# EasyEDA Pro project ProPrj_AS5600磁编码器板(For2804电机_2026-04-13.epro

# Schematic Schematic1
Create Date: 2023-10-13; Page Name: P1; Project Name: AS5600磁编码器板(For2804电机; Schematic Name: Schematic1; Update Date: 2023-10-13; Company: 嘉立创EDA; Page Size: A4; Version: V1.0
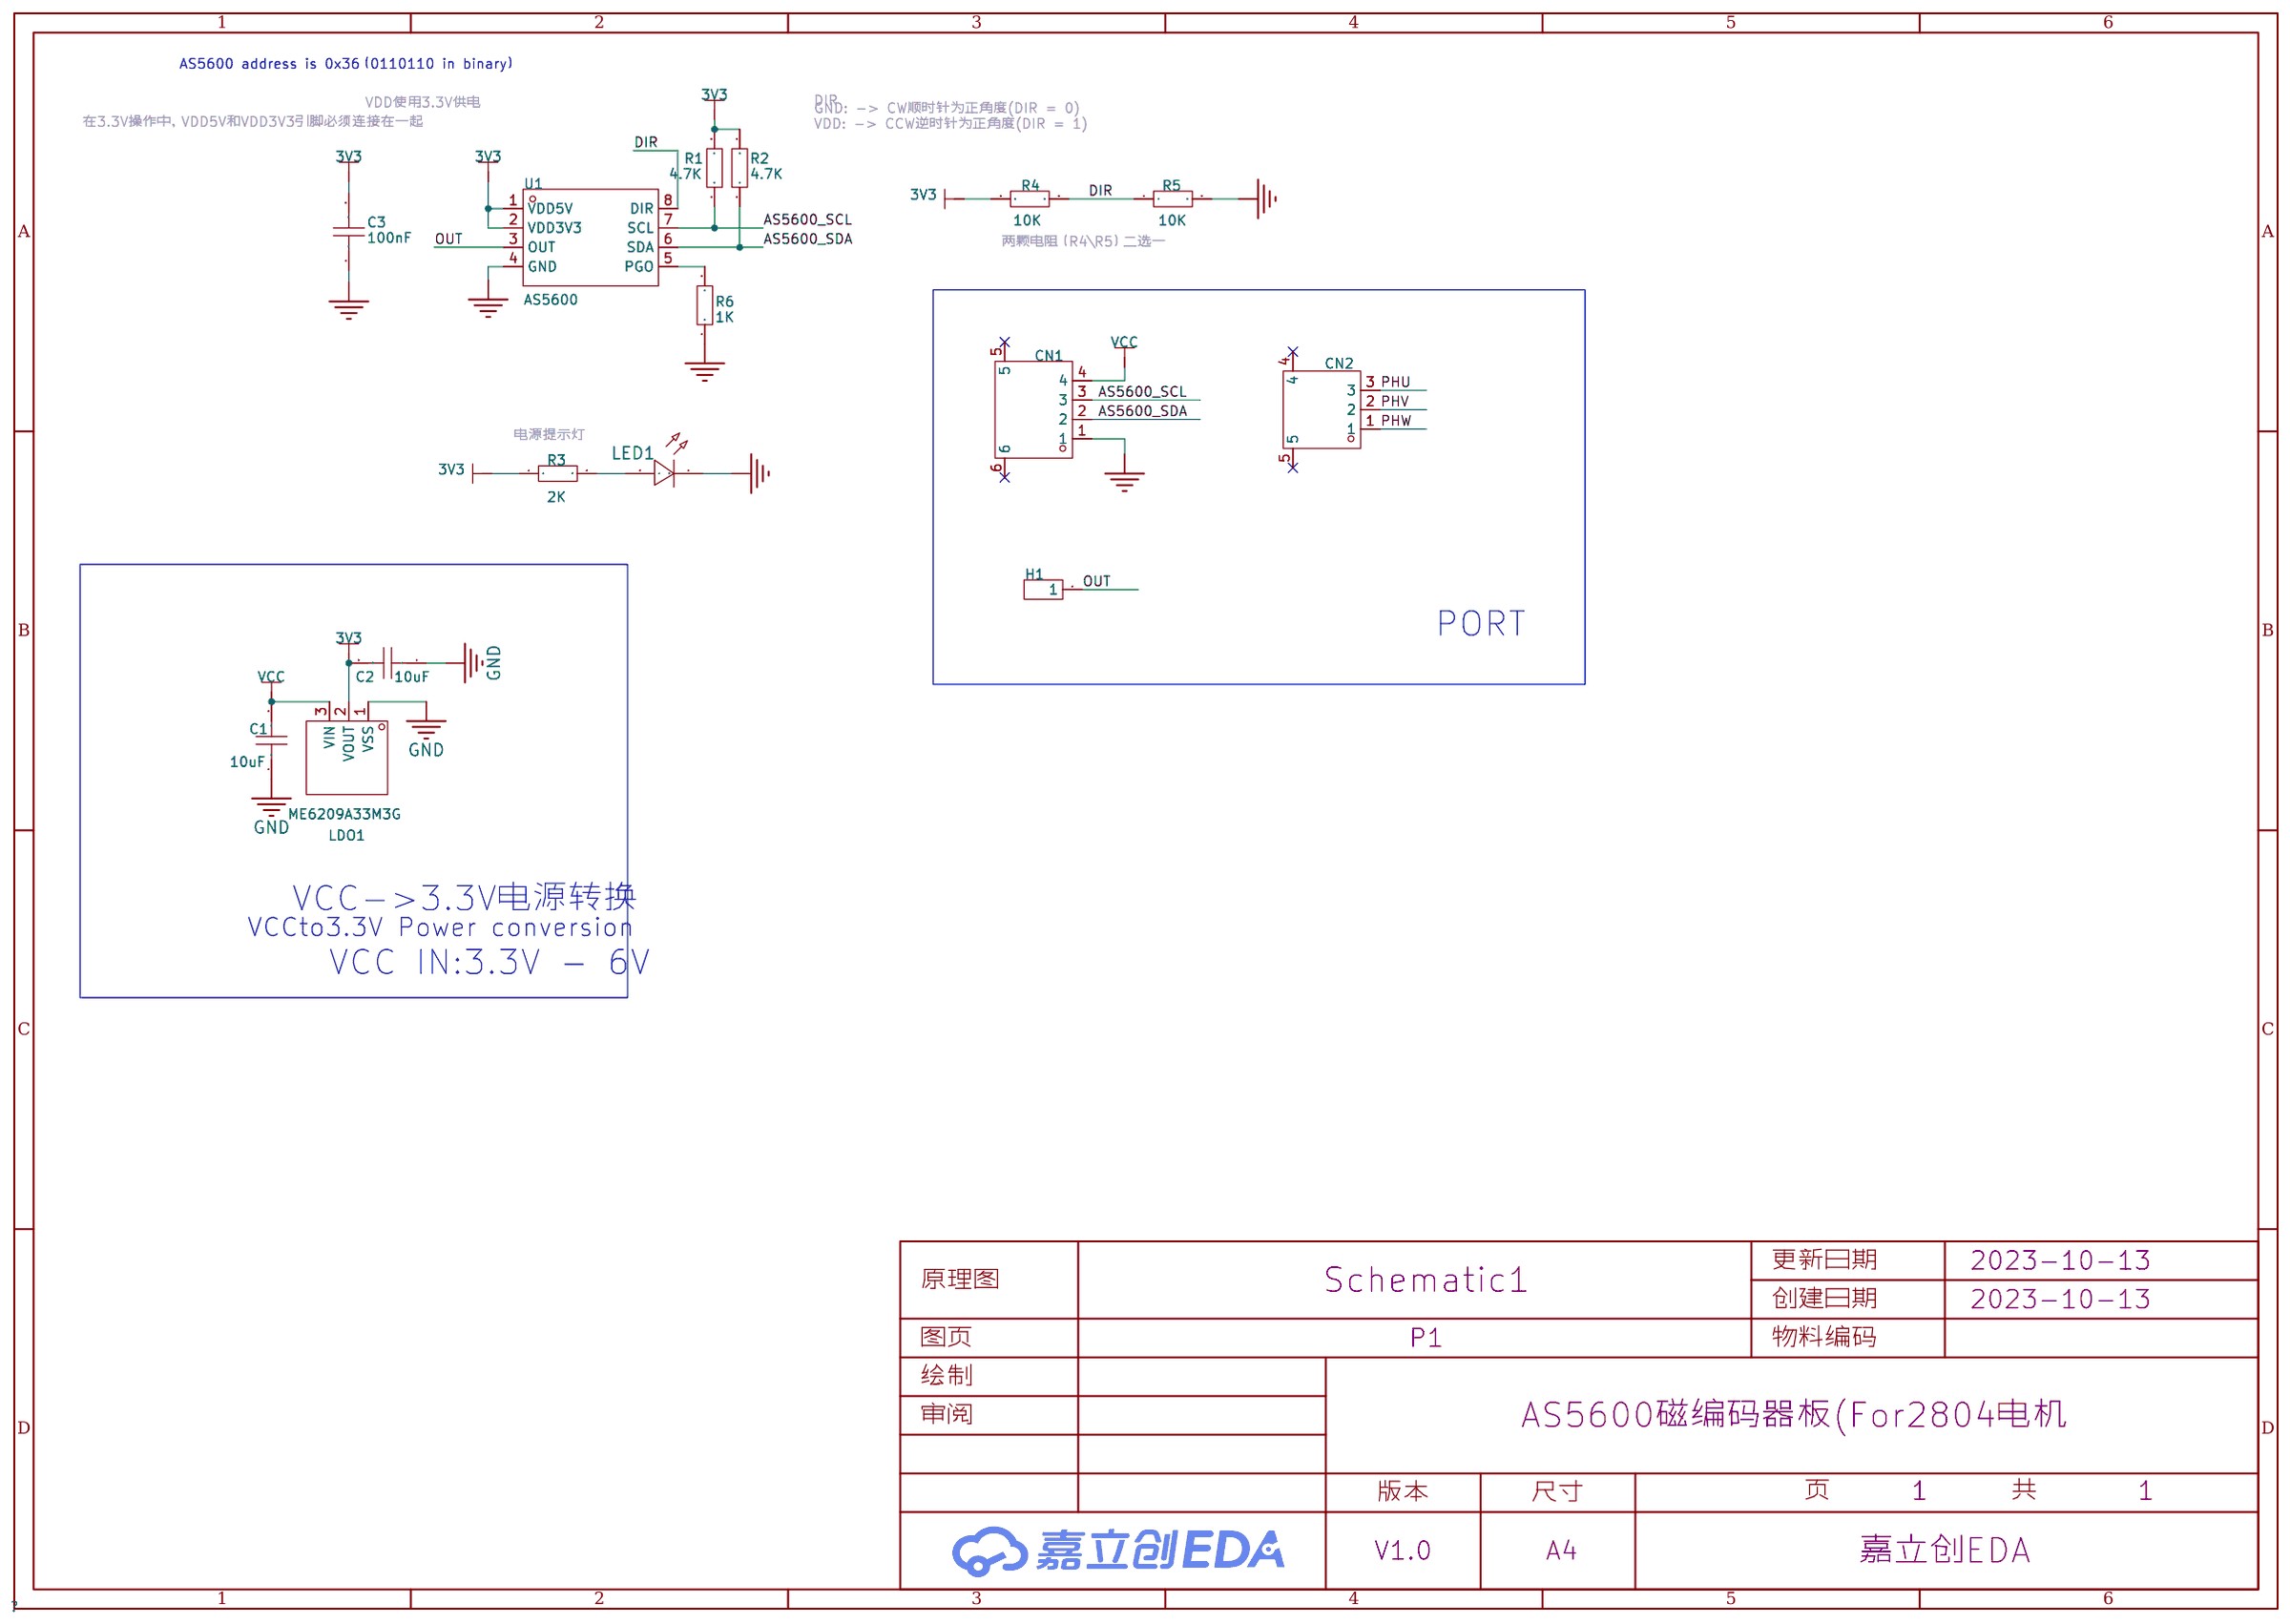
[diagram p0: schematic sheet]

## Parts
C1  10uF  [C0603]
C2  10uF  [C0603]
C3  100nF  [C0603]
CN1  A1002WR-S-4P  [CONN-SMD_A1002WR-S-4P]
CN2  A1002WR-S-3P  [CONN-SMD_A1002WR-S-3P]
H1  -  [HDR-TH_1P-V-M_XKB_X4611WV-01I-C28D40]
LDO1  ME6209A33M3G  [SOT-23-3_L2.9-W1.6-P1.90-LS2.8-BR]
LED1  -  [LED_0603]
R1  4.7K  [R0603]
R2  4.7K  [R0603]
R3  2K  [R0603]
R4  10K  [R0603]
R5  10K  [R0603]
R6  1K  [R0603]
U1  AS5600  [SOIC-8_L4.9-W3.9-P1.27-LS6.0-BL]

## Library data of the parts
C1-C3 = CAP_0603: Supplier Footprint: 0603
CN1 = A1002WR-S-4P: 参考系列:SH;间距:1mm;插针结构:1x4P;排数:1;每排PIN数:4;行距:-;安装方式:-;触头材质:磷青铜;; LCSC Part Name: SH 1mm 1x4P; Supplier Part: C239522; Manufacturer: CJT(长江连接器); Supplier Footprint: SMD,P=1mm; JLCPCB Part Class: 扩展库; Datasheet: https://atta.szlcsc.com/upload/public/pdf/source/20190523/C338919_26A19BC9BEDA3DBF5CB743676AAF20C3.pdf; Supplier: LCSC; Reference Series: SH; Pitch: 1mm; Pins Structure: 1x4P; Number of Rows: 1; Number of PINs Per Row: 4; Contact Material: 磷青铜
CN2 = A1002WR-S-3P: 系列:SH;连接器类型:接头;触头类型:公形引脚;间距:0.039"(1.00mm);针脚数:3;; LCSC Part Name: 3P,脚距1mm; Supplier Part: C239521; Manufacturer: CJT(长江连接器); Supplier Footprint: SMD,P=1mm; JLCPCB Part Class: 扩展库; Datasheet: https://atta.szlcsc.com/upload/public/pdf/watermark/20190926/C239521_19DE1B428A7F1E3979375D9C369EC94B.pdf; Supplier: LCSC; Series: SH; Connector Type: 接头; Contact Type: 公形引脚; Pitch: 0.039"(1.00mm); Number of Positions: 3; Number of Rows: 1; Mounting Type: 表面贴装; Contact Material: 磷青铜
H1 = HDR-M_2.54_1x1P: Supplier Part: C81276; Supplier Footprint: 插件; JLCPCB Part Class: Extended Part
LDO1 = ME6209A33M3G: 输出类型:固定;输出极性:正;最大输入电压:18V;输出电压:3.3V;输出电流:250mA;电源纹波抑制比(PSRR):-;; LCSC Part Name: 正 Vin=18V Vout=3.3V 250mA; Supplier Part: C83508; Manufacturer: MICRONE(南京微盟); Supplier Footprint: SOT-23-3L; JLCPCB Part Class: 扩展库; Datasheet: https://atta.szlcsc.com/upload/public/pdf/source/20161212/1481539101152.pdf; Supplier: LCSC; Output Type: 固定; Output Polarity: 正; Number of Outputs: 1; Maximum Input Voltage: 18V; Output Voltage: 3.3V; Dropout Voltage: 80mV@(40mA); Output Current: 250mA
LED1 = LED_0603-R: Supplier Footprint: 0603
R1 R2 R4-R6 = Res_0603: Supplier Footprint: 0603
R3 = Res_0402: Supplier Footprint: 0402
U1 = AS5600: Supplier Part: C9900021040; Supplier Footprint: SOIC-8; JLCPCB Part Class: 扩展库; Datasheet: https://atta.szlcsc.comnull; Supplier: LCSC

## Nets
3V3: C2.2 C3.2 LDO1.2(VOUT) R1.2 R2.2 R3.1 R4.1 U1.1(VDD5V) U1.2(VDD3V3)
GND: C1.1 C2.1 C3.1 CN1.1 LDO1.1(VSS) LED1.1(C) R5.2 R6.1 U1.4(GND)
VCC: C1.2 CN1.4 LDO1.3(VIN)
AS5600_SCL: CN1.3 R1.1 U1.7(SCL)
AS5600_SDA: CN1.2 R2.1 U1.6(SDA)
DIR: R4.2 R5.1 U1.8(DIR)
OUT: H1.1 U1.3(OUT)
PHU: CN2.3
PHV: CN2.2
PHW: CN2.1
$1N429: LED1.2(A) R3.2
$1N686: R6.2 U1.5(PGO)

Not connected (* = marked no-connect by the designer): CN1 5* 6*; CN2 4* 5*

## Notes on the sheet
- AS5600 address is 0x36（0110110 in binary）
- VDD使用3.3V供电
- DIR
- 在3.3V操作中，VDD5V和VDD3V3引脚必须连接在一起
- GND: -> CW顺时针为正角度(DIR = 0)
  VDD: -> CCW逆时针为正角度(DIR = 1)
- 两颗电阻（R4\R5）二选一
- 电源提示灯
- PORT
- VCC->3.3V电源转换
- VCCto3.3V Power conversion
- VCC IN:3.3V - 6V

# Schematic Schematic2
Create Date: 2024-04-01; Page Name: P1; Project Name: AS5600磁编码器板(For2804电机; Schematic Name: Schematic2; Update Date: 2024-04-01; Company: 嘉立创EDA; Page Size: A4; Version: V1.0
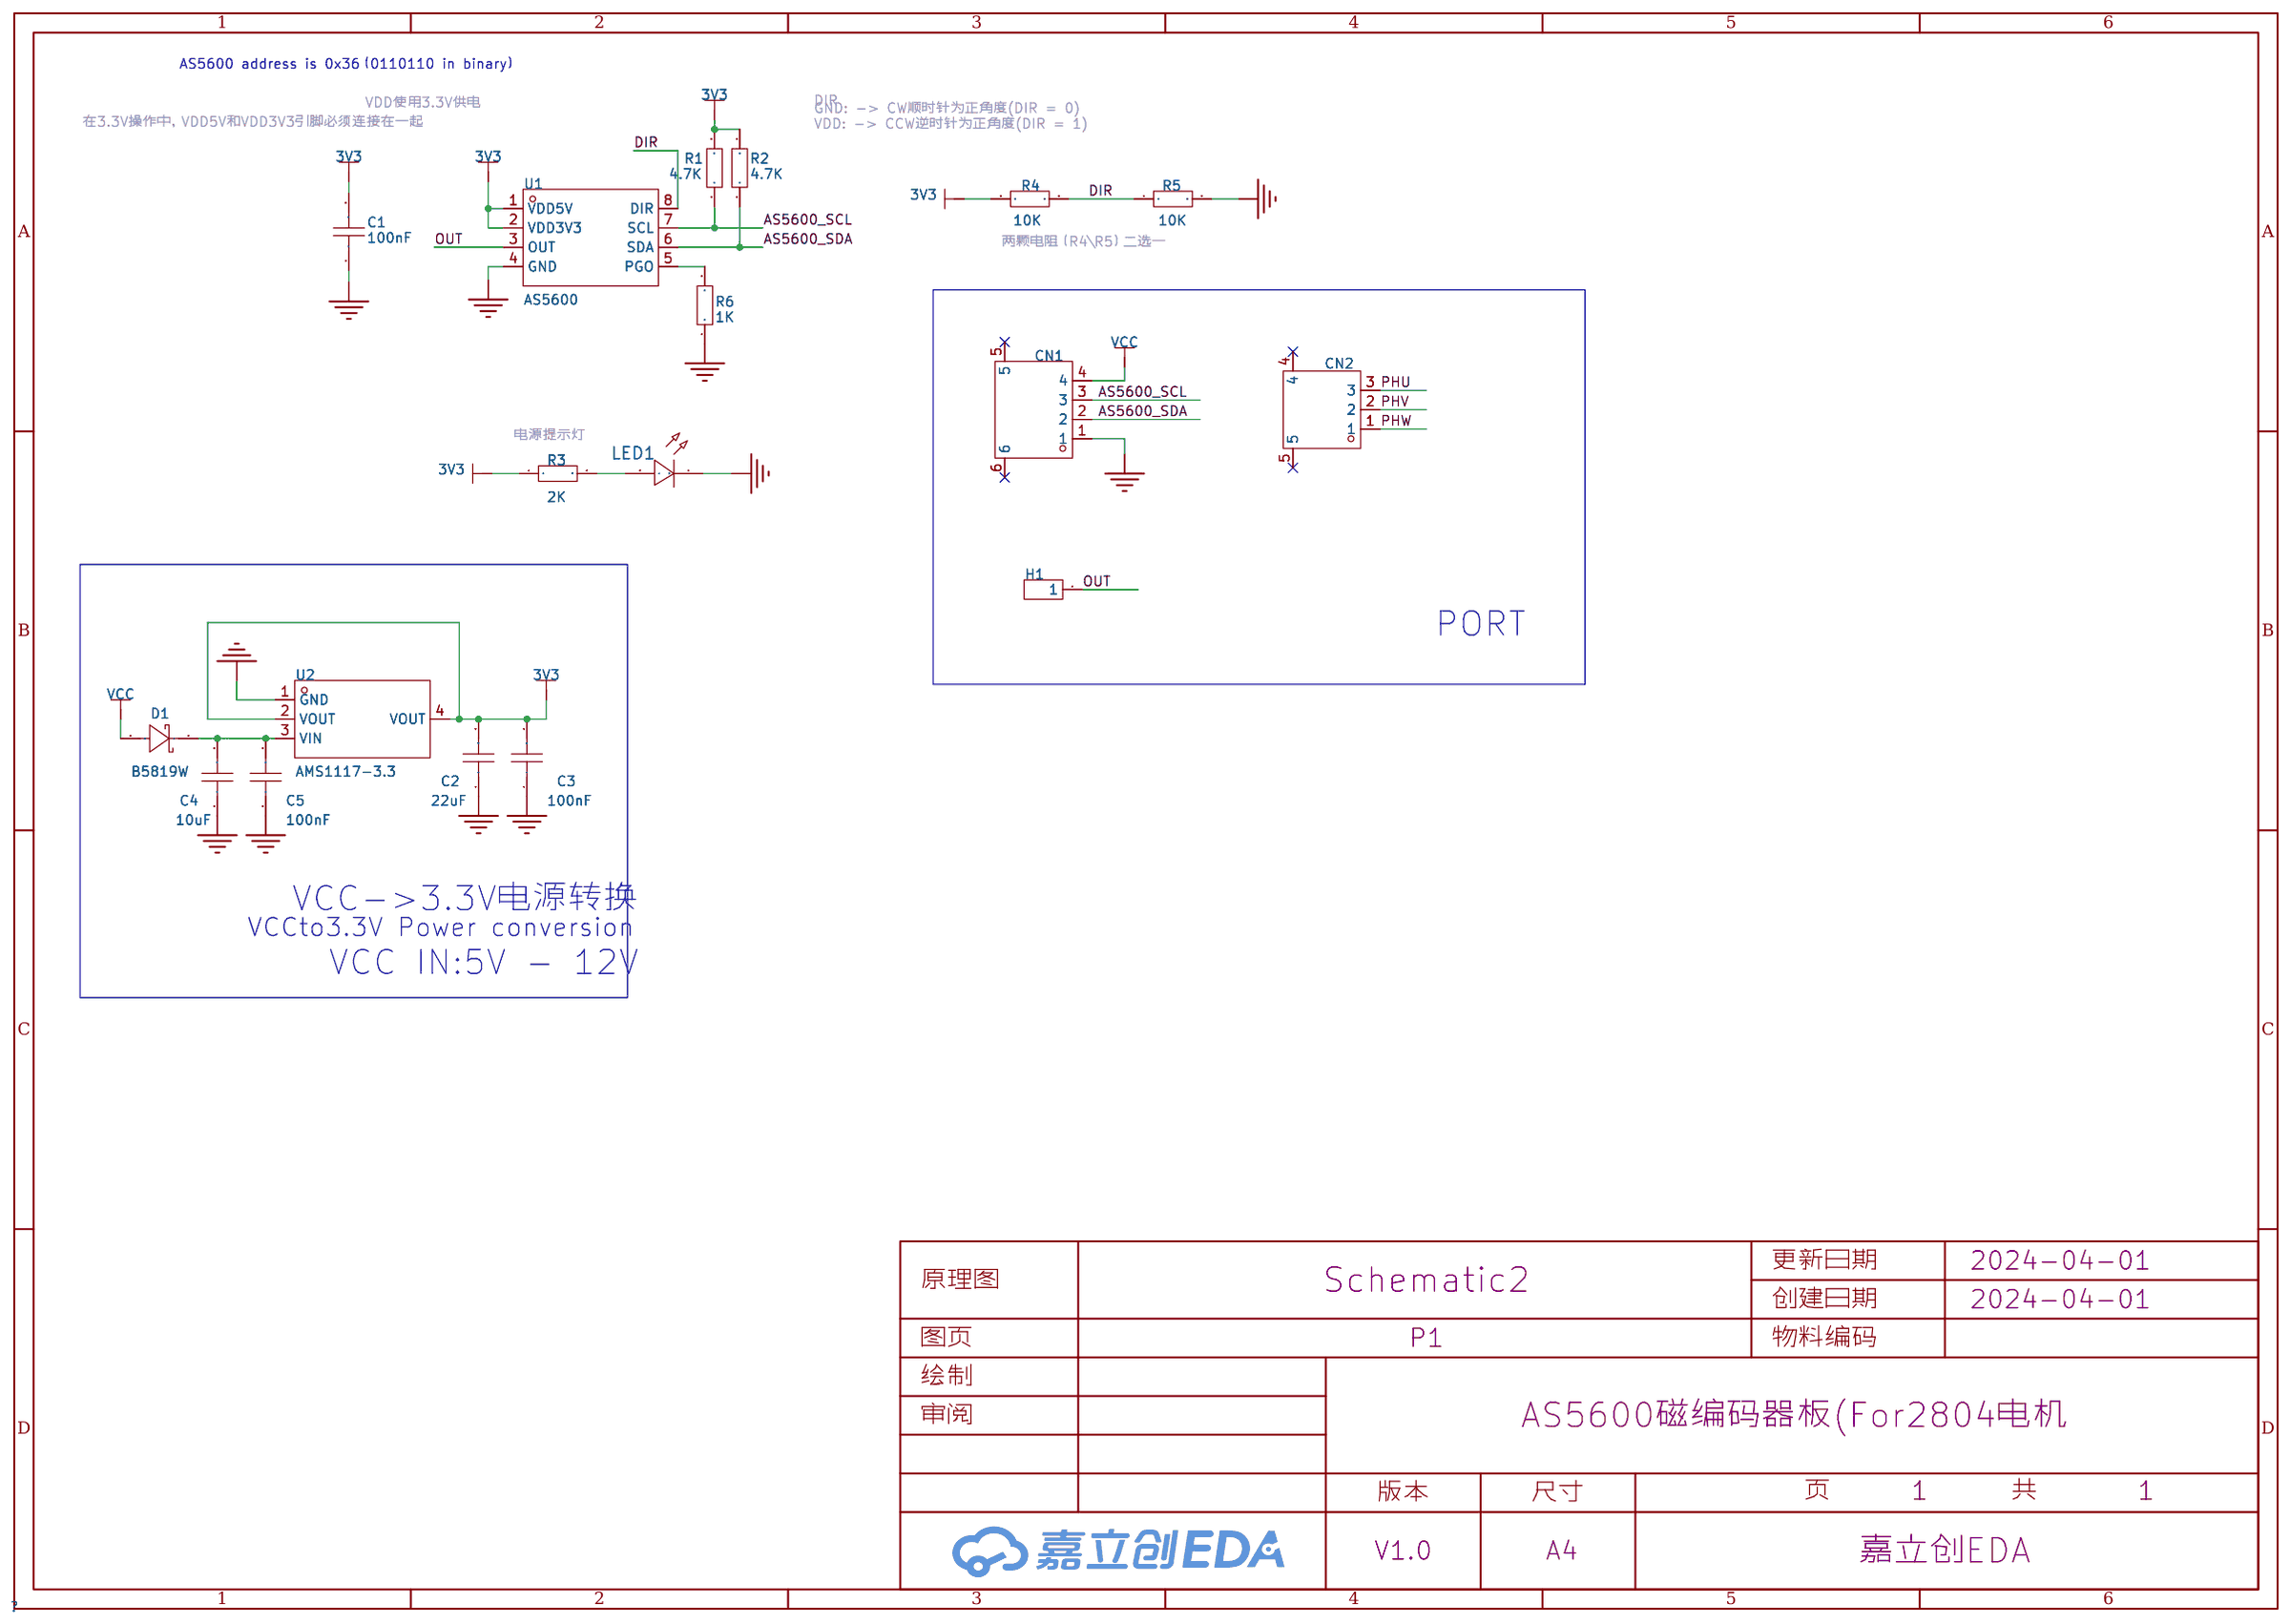
[diagram p1: schematic sheet]

## Parts
C1  100nF  [C0603]
C2  22uF  [C0603]
C3  100nF  [C0603]
C4  10uF  [C0603]
C5  100nF  [C0603]
CN1  A1002WR-S-4P  [CONN-SMD_A1002WR-S-4P]
CN2  A1002WR-S-3P  [CONN-SMD_A1002WR-S-3P]
D1  B5819W  [SOD-123F_L2.7-W1.6-LS3.8-RD-1]
H1  -  [HDR-TH_1P-V-M_XKB_X4611WV-01I-C28D40]
LED1  -  [LED_0603]
R1  4.7K  [R0603]
R2  4.7K  [R0603]
R3  2K  [R0603]
R4  10K  [R0603]
R5  10K  [R0603]
R6  1K  [R0603]
U1  AS5600  [SOIC-8_L4.9-W3.9-P1.27-LS6.0-BL]
U2  AMS1117-3.3  [SOT-223-3_L6.5-W3.4-P2.30-LS7.0-BR]

## Library data of the parts
C1-C5 = CAP_0603: Supplier Footprint: 0603
CN1 = A1002WR-S-4P: 参考系列:SH;间距:1mm;插针结构:1x4P;排数:1;每排PIN数:4;行距:-;安装方式:-;触头材质:磷青铜;; LCSC Part Name: SH 1mm 1x4P; Supplier Part: C239522; Manufacturer: CJT(长江连接器); Supplier Footprint: SMD,P=1mm; JLCPCB Part Class: 扩展库; Datasheet: https://atta.szlcsc.com/upload/public/pdf/source/20190523/C338919_26A19BC9BEDA3DBF5CB743676AAF20C3.pdf; Supplier: LCSC; Reference Series: SH; Pitch: 1mm; Pins Structure: 1x4P; Number of Rows: 1; Number of PINs Per Row: 4; Contact Material: 磷青铜
CN2 = A1002WR-S-3P: 系列:SH;连接器类型:接头;触头类型:公形引脚;间距:0.039"(1.00mm);针脚数:3;; LCSC Part Name: 3P,脚距1mm; Supplier Part: C239521; Manufacturer: CJT(长江连接器); Supplier Footprint: SMD,P=1mm; JLCPCB Part Class: 扩展库; Datasheet: https://atta.szlcsc.com/upload/public/pdf/watermark/20190926/C239521_19DE1B428A7F1E3979375D9C369EC94B.pdf; Supplier: LCSC; Series: SH; Connector Type: 接头; Contact Type: 公形引脚; Pitch: 0.039"(1.00mm); Number of Positions: 3; Number of Rows: 1; Mounting Type: 表面贴装; Contact Material: 磷青铜
D1 = B5819W: 二极管配置:-;正向压降(Vf):580mV@1A;直流反向耐压(Vr):40V;平均整流电流(Io):1A;; LCSC Part Name: 电压:40V 电流:1A; Supplier Part: C2943878; Manufacturer: GOODWORK(固得沃克); Supplier Footprint: SOD-123; JLCPCB Part Class: 扩展库; Datasheet: https://atta.szlcsc.com/upload/public/pdf/source/20220114/81042131F39C8520B6390246D7392C1A.pdf; Supplier: LCSC; Forward Voltage (Vf@If): 580mV@1A; Reverse Voltage (Vr): 40V; Average Rectified Current (Io): 1A; Reverse Leakage Current (Ir): 50uA@40V
H1 = HDR-M_2.54_1x1P: Supplier Part: C81276; Supplier Footprint: 插件; JLCPCB Part Class: Extended Part
LED1 = LED_0603-R: Supplier Footprint: 0603
R1 R2 R4-R6 = Res_0603: Supplier Footprint: 0603
R3 = Res_0402: Supplier Footprint: 0402
U1 = AS5600: Supplier Part: C9900021040; Supplier Footprint: SOIC-8; JLCPCB Part Class: 扩展库; Datasheet: https://atta.szlcsc.comnull; Supplier: LCSC
U2 = AMS1117-3.3_C6186: 输出类型:固定;最大输入电压:-;输出电压:3.3V;最大输出电流:1A;电源纹波抑制比(PSRR):72dB@(120Hz);输出极性:正极;; LCSC Part Name: 输出3.3V 1A; Supplier Part: C6186; Manufacturer: AMS; Supplier Footprint: SOT-223-3; JLCPCB Part Class: 基础库; Datasheet: https://atta.szlcsc.com/upload/public/pdf/source/20180727/C6186_7A095716F0823C02F1997A905E26C086.pdf; Supplier: LCSC; Output Type: 固定; Output Voltage: 3.3V; MAX Output Current: 1A; Power Supply Rejection Ratio (PSRR): 72dB@(120Hz); Dropout Voltage: 1.3V@(800mA); Output Polarity: 正极; Number of Outputs: 1

## Nets
3V3: C1.2 C2.2 C3.2 R1.2 R2.2 R3.1 R4.1 U1.1(VDD5V) U1.2(VDD3V3) U2.2(VOUT) U2.4(VOUT)
GND: C1.1 C2.1 C3.1 C4.1 C5.1 CN1.1 LED1.1(C) R5.2 R6.1 U1.4(GND) U2.1(GND)
VCC: CN1.4 D1.2(A)
AS5600_SCL: CN1.3 R1.1 U1.7(SCL)
AS5600_SDA: CN1.2 R2.1 U1.6(SDA)
DIR: R4.2 R5.1 U1.8(DIR)
OUT: H1.1 U1.3(OUT)
PHU: CN2.3
PHV: CN2.2
PHW: CN2.1
$1N429: LED1.2(A) R3.2
$1N686: R6.2 U1.5(PGO)
$1N2645: C4.2 C5.2 D1.1(K) U2.3(VIN)

Not connected (* = marked no-connect by the designer): CN1 5* 6*; CN2 4* 5*

## Notes on the sheet
- AS5600 address is 0x36（0110110 in binary）
- VDD使用3.3V供电
- DIR
- 在3.3V操作中，VDD5V和VDD3V3引脚必须连接在一起
- GND: -> CW顺时针为正角度(DIR = 0)
  VDD: -> CCW逆时针为正角度(DIR = 1)
- 两颗电阻（R4\R5）二选一
- 电源提示灯
- PORT
- VCC->3.3V电源转换
- VCCto3.3V Power conversion
- VCC IN:5V - 12V

# Board PCB1
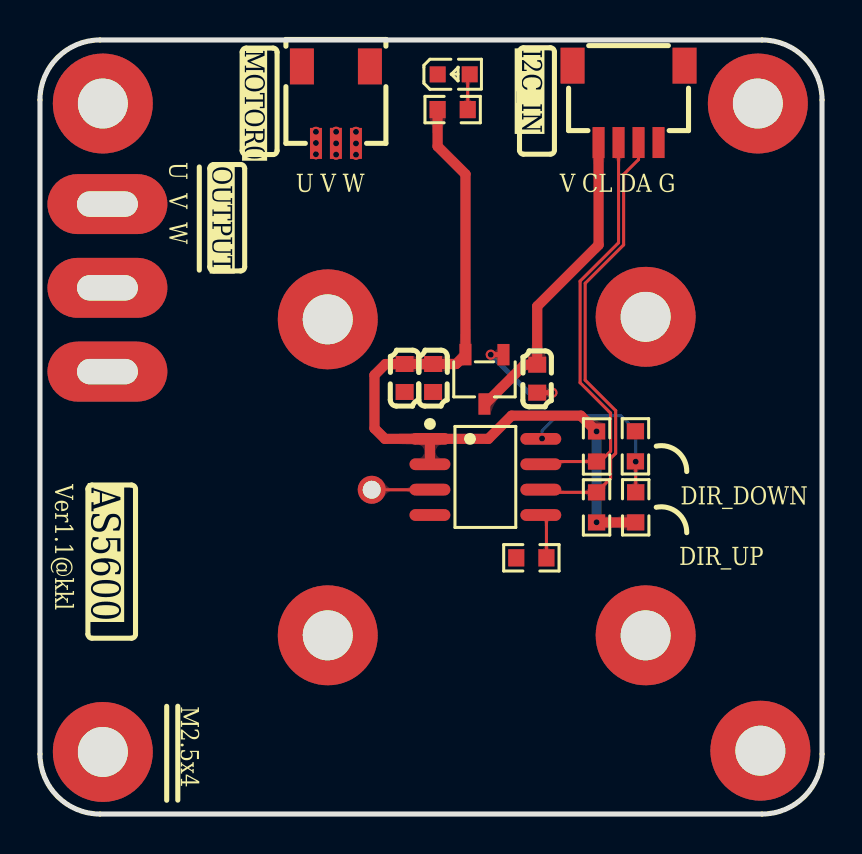
[diagram p2: board, top side]
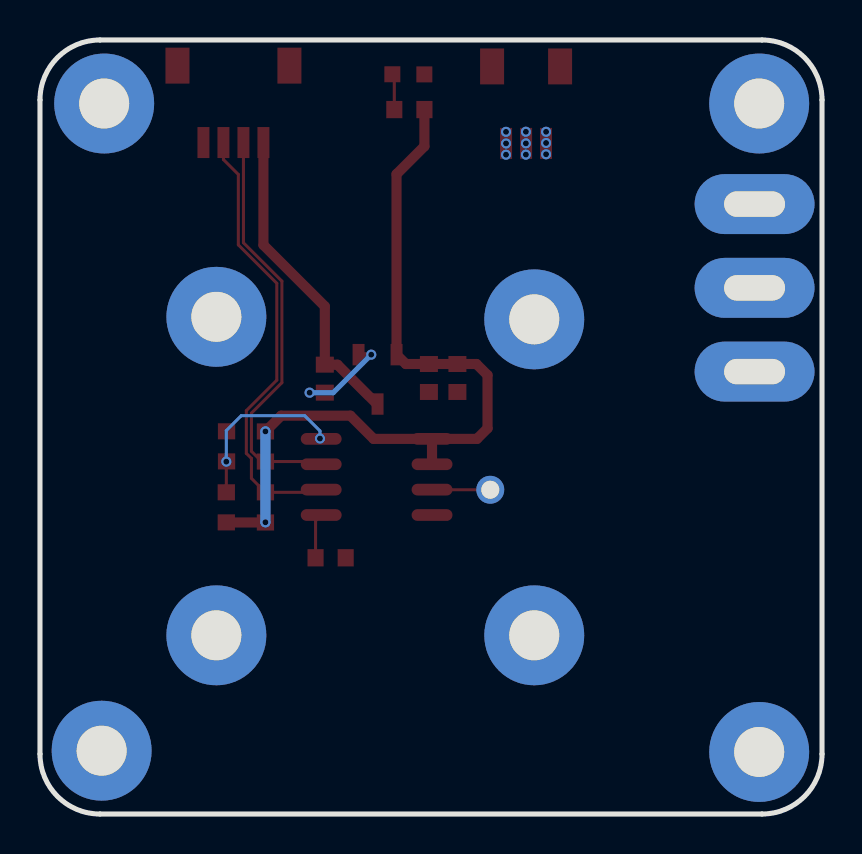
[diagram p3: board, bottom side, seen from below]

Outline 39.12 x 38.73 mm; copper layers: Top Layer, Bottom Layer. Coordinates in mm from the lower left corner of the outline.
Outline path: 0,35.73 0,3 arc(0.88,0.88) 3,0 36.12,0 arc(38.24,0.88) 39.12,3 39.12,35.73 arc(38.24,37.86) 36.12,38.73 3,38.73 arc(0.88,37.86) 0,35.73
Stack: Top Layer 0.035mm / Dielectric1 1.51mm FR4 er 4.5 / Bottom Layer 0.035mm

## Design rules (mm)
template: 自定义配置
spacing copperThickness1oz (default): track to track 0.102, other pairs 0.152 to 0.3
spacing copperThickness2oz: track to track 0.203, other pairs 0.152 to 0.3
track width copperThickness1oz (default): min 0.127, default 0.254, max 2.54
track width copperThickness2oz: min 0.203, default 0.254, max 2.54
differential pair differentialPair (default): width min 0.127, default 0.254, max 2.54; gap min 0.152, default 0.152
via viaSize (default): diameter min 0.5, default 0.61, max 10; hole min 0.3, default 0.305, max 6.3
net GND uses 大师规则
net PHW uses 大师规则
net PHV uses 大师规则
net PHU uses 大师规则
pour e335 uses copperRegion

## Placement (name value [footprint] x y rotation side)
C1  10uF  [C0603]  24.87 21.78 90 top
C2  10uF  [C0603]  19.66 21.82 90 top
C3  100nF  [C0603]  18.24 21.82 90 top
CN1  A1002WR-S-4P  [CONN-SMD_A1002WR-S-4P]  29.44 35.53 180 top
CN2  A1002WR-S-3P  [CONN-SMD_A1002WR-S-3P]  14.8 35.48 180 top
H1  -  [HDR-TH_1P-V-M_XKB_X4611WV-01I-C28D40]  16.59 16.23 90 bottom
LDO1  ME6209A33M3G  [SOT-23-3_L2.9-W1.6-P1.90-LS2.8-BR]  22.23 21.75 90 top
LED1  -  [LED_0603]  20.74 37.02 0 top
NOREF  -  [Pad_e50]  35.91 35.55 270 top
NOREF#2  -  [Pad_e23]  30.3 24.88 270 top
NOREF#3  -  [Pad_ie14]  3.37 26.33 270 top
NOREF#4  -  [Pad_e25]  30.3 8.94 270 top
NOREF#5  -  [Pad_e48]  3.14 35.55 270 top
NOREF#6  -  [Pad_ie17]  3.37 22.14 270 top
NOREF#7  -  [Pad_e27]  14.4 24.75 270 top
NOREF#8  -  [Pad_e26]  14.4 8.94 270 top
NOREF#9  -  [Pad_ie15]  3.37 30.52 270 top
NOREF#10  -  [Pad_e51]  36.04 3.17 270 top
NOREF#11  -  [Pad_e49]  3.14 3.11 270 top
R1  4.7K  [R0603]  27.84 18.39 90 top
R2  4.7K  [R0603]  27.84 15.34 270 top
R3  2K  [R0603]  20.64 35.25 0 top
R4  10K  [R0603]  29.8 15.35 90 top
R5  10K  [R0603]  29.79 18.4 90 top
R6  1K  [R0603]  24.58 12.82 0 top
U1  AS5600  [SOIC-8_L4.9-W3.9-P1.27-LS6.0-BL]  22.28 16.87 270 top

## Footprints (pads in the part's own frame, mm; a bottom-side part is the same pattern mirrored in y, then rotated)
C0603
  rect 0.8x0.9 smd: 1(-0.7,0) 2(0.7,0)
CONN-SMD_A1002WR-S-3P
  rect 0.6x1.55 smd: 1(-1.003,1.926) 2(-0.001,1.925) 3(0.997,1.926)
  rect 1.2x1.8 smd: 4(1.701,-1.926) 5(-1.701,-1.926)
CONN-SMD_A1002WR-S-4P
  rect 0.6x1.55 smd: 1(-1.5,1.925) 2(-0.5,1.925) 3(0.5,1.925) 4(1.5,1.925)
  rect 1.2x1.8 smd: 5(2.8,-1.925) 6(-2.8,-1.925)
HDR-TH_1P-V-M_XKB_X4611WV-01I-C28D40
  round 1.4 hole 0.9: 1(0,0)
LED_0603
  rect 0.8x0.8 smd: 1(-0.851,-0.01) 2(0.75,-0.005)
Pad_e23
  round 5 hole 2.5: 9(0,0)
Pad_e25
  round 5 hole 2.5: 9(0,0)
Pad_e26
  round 5 hole 2.5: 9(0,0)
Pad_e27
  round 5 hole 2.5: 9(0,0)
Pad_e48
  round 5 hole 2.5: 9(0,0)
Pad_e49
  round 5 hole 2.5: 9(0,0)
Pad_e50
  round 5 hole 2.5: 9(0,0)
Pad_e51
  round 5 hole 2.5: 9(0,0)
Pad_ie14
  rrect 3x6 hole 1.27x3.048: (0,0)
Pad_ie15
  rrect 3x6 hole 1.27x3.048: (0,0)
Pad_ie17
  rrect 3x6 hole 1.27x3.048: (0,0)
R0603
  rect 0.806x0.864 smd: 1(-0.753,0) 2(0.753,0)
SOIC-8_L4.9-W3.9-P1.27-LS6.0-BL
  oval 0.588x2.045 smd: 1(-1.905,-2.772) 2(-0.635,-2.772) 3(0.635,-2.772) 4(1.905,-2.772) 5(1.905,2.772) 6(0.635,2.772) 7(-0.635,2.772) 8(-1.905,2.772)
SOT-23-3_L2.9-W1.6-P1.90-LS2.8-BR
  rect 1.07x0.6 smd: 1(1.235,-0.95) 2(1.235,0.95) 3(-1.235,0)

## Nets
3V3: C2.2 C3.2 LDO1.2 R1.2 R2.2 R3.1 R4.1 U1.1 U1.2
GND: C1.1 C2.1 C3.1 CN1.1 LDO1.1 LED1.1 R5.2 R6.1 U1.4
VCC: C1.2 CN1.4 LDO1.3
AS5600_SCL: CN1.3 R1.1 U1.7
AS5600_SDA: CN1.2 R2.1 U1.6
DIR: R4.2 R5.1 U1.8
OUT: H1.1 U1.3
PHU: CN2.3 NOREF#9.
PHV: CN2.2 NOREF#3.
PHW: CN2.1 NOREF#6.
$1N429: LED1.2 R3.2
$1N686: R6.2 U1.5

Pads without a net: CN1 5 6; CN2 4 5; NOREF 9; NOREF#2 9; NOREF#4 9; NOREF#5 9; NOREF#7 9; NOREF#8 9; NOREF#10 9; NOREF#11 9

## Via types
v1: diameter 0.508, hole 0.3, Top Layer to Bottom Layer, 15 vias

## Routing (per net, layer and track width the routed paths; a pad name or vN(x,y) marks a point on that pad's centre or on a via; arc(x,y) is an arc through that point)
3V3: length 40.4
  Top Layer w0.152: v1(27.84,14.6) R2.2
  Top Layer w0.508: v1(27.84,19.15) 27.06,19.93 23.59,19.93 22.43,18.77 U1.1 ; U1.1 U1.2 ; U1.1 17.26,18.77 16.73,19.3 16.73,21.97 17.29,22.52 C3.2 C2.2 20.82,22.52 LDO1.2 21.28,32.02 19.89,33.41 R3.1 ; R4.1 29.8,14.59 R2.2
  Bottom Layer w0.508: v1(27.84,19.15) v1(27.84,14.6)
GND: length 5.3
  Top Layer w0.254: LDO1.1 v1(22.55,22.99) ; C1.1 v1(25.63,21.09)
  Bottom Layer w0.254: v1(22.55,22.99) 24.45,21.09 v1(25.63,21.09)
VCC: length 15.8
  Top Layer w0.508: LDO1.3 22.27,20.52 24.24,22.48 C1.2 24.87,25.41 27.94,28.48 CN1.4
AS5600_SCL: length 20.6
  Top Layer w0.152: U1.7 25.19,17.64 R1.1 28.03,17.64 28.54,18.16 28.54,20.06 27.02,21.58 27.02,26.66 28.94,28.59 CN1.3
AS5600_SDA: length 22.5
  Top Layer w0.152: U1.6 25.19,16.1 27.84,16.1 28.54,16.8 28.54,17.8 28.8,18.05 28.8,20.19 27.27,21.71 27.27,26.56 29.2,28.48 29.2,32 29.94,32.75 CN1.2
DIR: length 8.9
  Top Layer w0.152: R4.2 v1(29.8,17.63) R5.1 ; U1.8 25.1,18.77 v1(25.11,18.79)
  Bottom Layer w0.152: v1(29.8,17.63) 29.8,19.18 29.05,19.93 25.88,19.93 25.11,19.17 v1(25.11,18.79)
OUT: length 2.9
  Top Layer w0.152: U1.3 19.5,16.23 H1.1
PHU:
  vias: v1(13.8,34.14) v1(13.8,33.58) v1(13.8,33.01)
PHV:
  vias: v1(14.81,34.14) v1(14.81,33.56) v1(14.81,33)
PHW:
  vias: v1(15.81,34.14) v1(15.81,33.56) v1(15.81,32.99)
$1N429: length 1.8
  Top Layer w0.152: LED1.2 21.4,36.92 R3.2
$1N686: length 2.3
  Top Layer w0.152: R6.2 25.33,14.68 U1.5

## Copper pours and planes (outline as drawn; the poured copper is in the pictures)
GND on Top Layer: -6.51,42.54 40.1,42.54 40.1,-0.89 -6.51,-0.89
GND on Bottom Layer: -3.97,45.21 40.74,45.21 40.74,-1.4 -3.97,-1.4
PHU on Top Layer: 0.35,31.74 0.87,32.27 0.89,32.27 6.71,32.27 6.73,32.28 8.85,34.4 8.87,34.41 13.46,34.39 14.15,34.39 14.15,34.4 14.15,32.78 14.14,32.76 14.13,32.75 14.12,32.74 10.18,32.74 6.19,28.75 6.17,28.74 0.94,28.74 0.35,29.33
PHU on Bottom Layer: 0.35,31.75 0.87,32.27 0.89,32.28 6.71,32.28 6.73,32.29 8.85,34.41 8.88,34.42 13.47,34.4 14.15,34.4 14.16,34.4 14.16,32.78 14.15,32.76 14.14,32.75 14.12,32.75 10.19,32.75 6.19,28.75 6.17,28.74 0.95,28.74 0.35,29.34
PHV on Top Layer: 14.46,34.4 15.16,34.4 15.16,34.4 15.16,32.65 7.03,24.52 1.04,24.52 0.32,25.24 0.32,27.45 1.04,28.17 6.22,28.17 10.5,32.45 14.22,32.45 14.46,32.68
PHV on Bottom Layer: 14.46,34.4 15.16,34.4 15.16,34.41 15.16,32.65 7.03,24.52 1.04,24.52 0.32,25.24 0.32,27.45 1.04,28.17 6.22,28.17 10.5,32.45 14.23,32.45 14.46,32.68
PHW on Top Layer: 15.46,34.39 16.16,34.39 16.16,32.73 16.16,30.43 11.27,25.54 11.27,23.81 8.03,20.57 0.75,20.57 0.31,21.01 0.31,23.22 0.9,23.81 6.83,23.81 15.46,32.44
PHW on Bottom Layer: 15.46,34.4 16.17,34.4 16.17,32.73 16.16,30.44 11.27,25.55 11.27,23.81 8.04,20.58 0.75,20.58 0.31,21.02 0.31,23.23 0.9,23.81 6.83,23.81 15.46,32.44

Small or netless copper shapes (teardrops, artwork), in the pictures only: 37 on Top Layer, 4 on Bottom Layer

## Text on the board
Top Silkscreen Layer: Ver1.1@kkl | U  V  W | U V W | V CL DA G | DIR_UP | DIR_DOWN | M2.5x4 | OUTPUT | MOTOR0 | I2C_IN | AS5600

# Board PCB2
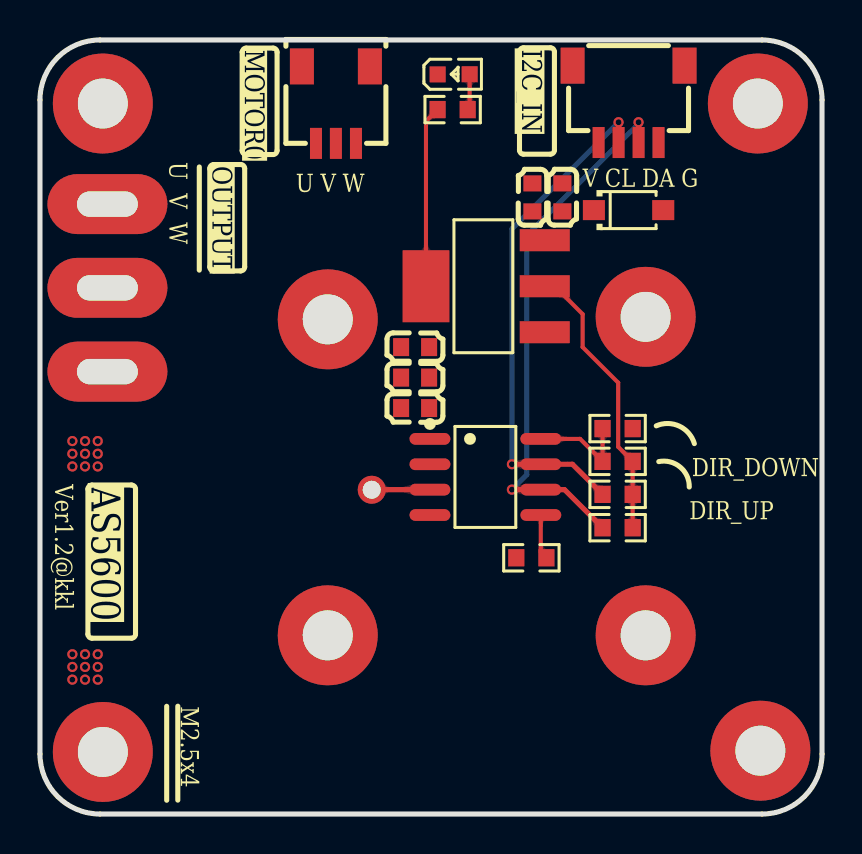
[diagram p4: board, top side]
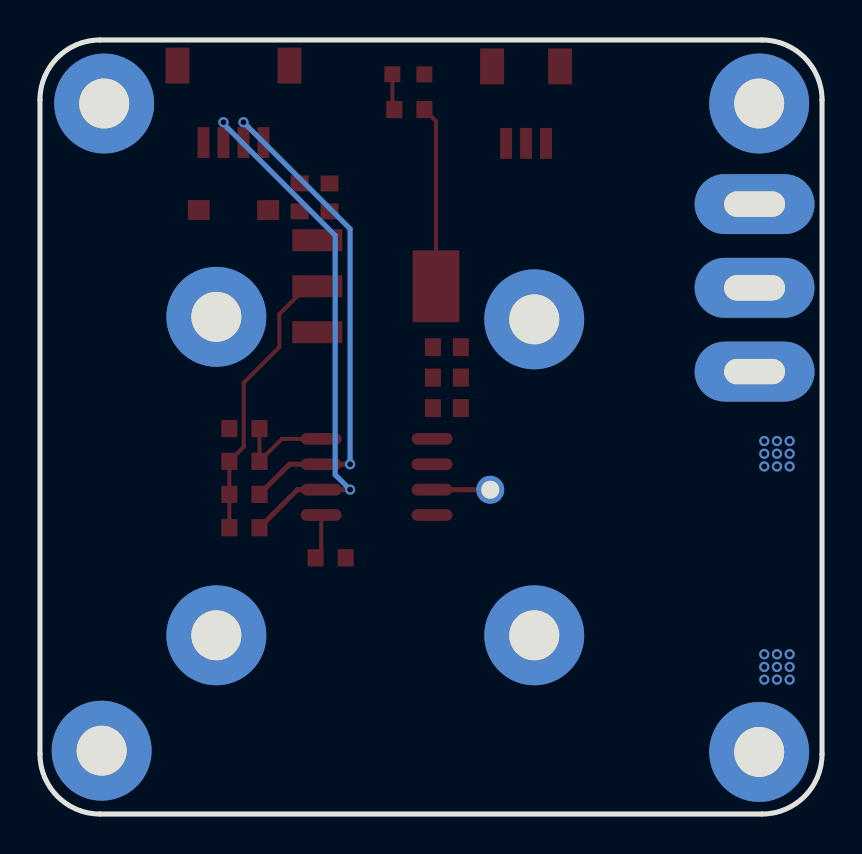
[diagram p5: board, bottom side, seen from below]

Outline 39.12 x 38.73 mm; copper layers: Top Layer, Bottom Layer. Coordinates in mm from the lower left corner of the outline.
Outline path: 0,35.73 0,3 arc(0.88,0.88) 3,0 36.12,0 arc(38.24,0.88) 39.12,3 39.12,35.73 arc(38.24,37.86) 36.12,38.73 3,38.73 arc(0.88,37.86) 0,35.73
Stack: Top Layer 0.035mm / Dielectric1 1.51mm FR4 er 4.5 / Bottom Layer 0.035mm

## Design rules (mm)
template: 自定义配置
spacing copperThickness1oz (default): track to track 0.102, other pairs 0.152 to 0.3
spacing copperThickness2oz: track to track 0.203, other pairs 0.152 to 0.3
track width copperThickness1oz (default): min 0.127, default 0.254, max 2.54
track width copperThickness2oz: min 0.203, default 0.254, max 2.54
differential pair differentialPair (default): width min 0.127, default 0.254, max 2.54; gap min 0.152, default 0.152
via viaSize (default): diameter min 0.5, default 0.61, max 10; hole min 0.3, default 0.305, max 6.3
net PHW uses 大师规则
net PHV uses 大师规则
net PHU uses 大师规则

## Placement (name value [footprint] x y rotation side)
C1  100nF  [C0603]  18.76 20.31 0 top
C2  22uF  [C0603]  18.76 23.36 0 top
C3  100nF  [C0603]  18.76 21.84 0 top
C4  10uF  [C0603]  26.13 30.86 270 top
C5  100nF  [C0603]  24.64 30.86 270 top
CN1  A1002WR-S-4P  [CONN-SMD_A1002WR-S-4P]  29.44 35.53 180 top
CN2  A1002WR-S-3P  [CONN-SMD_A1002WR-S-3P]  14.8 35.48 180 top
D1  B5819W  [SOD-123F_L2.7-W1.6-LS3.8-RD-1]  29.44 30.22 0 top
H1  -  [hdr-th_1p-v-m_xkb_x4611wv-01i-c28d40]  16.59 16.23 90 bottom
LED1  -  [LED_0603]  20.74 37.02 0 top
NOREF  -  [Pad_e23]  30.3 24.88 270 top
NOREF#2  -  [Pad_e25]  30.3 8.94 270 top
NOREF#3  -  [Pad_ie15]  3.37 30.52 270 top
NOREF#4  -  [Pad_e49]  3.14 3.11 270 top
NOREF#5  -  [Pad_e26]  14.4 8.94 270 top
NOREF#6  -  [Pad_ie14]  3.37 26.33 270 top
NOREF#7  -  [Pad_e51]  36.04 3.17 270 top
NOREF#8  -  [Pad_ie17]  3.37 22.14 270 top
NOREF#9  -  [Pad_e48]  3.14 35.55 270 top
NOREF#10  -  [Pad_e50]  35.91 35.55 270 top
NOREF#11  -  [Pad_e27]  14.4 24.75 270 top
R1  4.7K  [R0603]  28.9 16 0 top
R2  4.7K  [R0603]  28.9 14.33 0 top
R3  2K  [R0603]  20.64 35.25 0 top
R4  10K  [R0603]  28.9 17.65 180 top
R5  10K  [R0603]  28.9 19.29 0 top
R6  1K  [R0603]  24.58 12.82 0 top
U1  AS5600  [SOIC-8_L4.9-W3.9-P1.27-LS6.0-BL]  22.28 16.87 270 top
U2  AMS1117-3.3  [SOT-223-3_L6.5-W3.4-P2.30-LS7.0-BR]  22.28 26.41 0 top

## Footprints (pads in the part's own frame, mm; a bottom-side part is the same pattern mirrored in y, then rotated)
C0603
  rect 0.8x0.9 smd: 1(-0.7,0) 2(0.7,0)
CONN-SMD_A1002WR-S-3P
  rect 0.6x1.55 smd: 1(-1.003,1.926) 2(-0.001,1.925) 3(0.997,1.926)
  rect 1.2x1.8 smd: 4(1.701,-1.926) 5(-1.701,-1.926)
CONN-SMD_A1002WR-S-4P
  rect 0.6x1.55 smd: 1(-1.5,1.925) 2(-0.5,1.925) 3(0.5,1.925) 4(1.5,1.925)
  rect 1.2x1.8 smd: 5(2.8,-1.925) 6(-2.8,-1.925)
hdr-th_1p-v-m_xkb_x4611wv-01i-c28d40
  round 1.4 hole 0.9: 1(0,0)
LED_0603
  rect 0.8x0.8 smd: 1(-0.851,-0.01) 2(0.75,-0.005)
Pad_e23
  round 5 hole 2.5: 9(0,0)
Pad_e25
  round 5 hole 2.5: 9(0,0)
Pad_e26
  round 5 hole 2.5: 9(0,0)
Pad_e27
  round 5 hole 2.5: 9(0,0)
Pad_e48
  round 5 hole 2.5: 9(0,0)
Pad_e49
  round 5 hole 2.5: 9(0,0)
Pad_e50
  round 5 hole 2.5: 9(0,0)
Pad_e51
  round 5 hole 2.5: 9(0,0)
Pad_ie14
  rrect 3x6 hole 1.27x3.048: (0,0)
Pad_ie15
  rrect 3x6 hole 1.27x3.048: (0,0)
Pad_ie17
  rrect 3x6 hole 1.27x3.048: (0,0)
R0603
  rect 0.806x0.864 smd: 1(-0.753,0) 2(0.753,0)
SOD-123F_L2.7-W1.6-LS3.8-RD-1
  rect 1.1x1 smd: 1(-1.735,0) 2(1.735,0)
SOIC-8_L4.9-W3.9-P1.27-LS6.0-BL
  oval 0.588x2.045 smd: 1(-1.905,-2.772) 2(-0.635,-2.772) 3(0.635,-2.772) 4(1.905,-2.772) 5(1.905,2.772) 6(0.635,2.772) 7(-0.635,2.772) 8(-1.905,2.772)
SOT-223-3_L6.5-W3.4-P2.30-LS7.0-BR
  rect 2.5x1.1 smd: 1(2.97,-2.3) 2(2.97,0) 3(2.97,2.3)
  rect 2.34x3.6 smd: 4(-2.97,0)

## Nets
3V3: C1.2 C2.2 C3.2 R1.2 R2.2 R3.1 R4.1 U1.1 U1.2 U2.2 U2.4
GND: C1.1 C2.1 C3.1 C4.1 C5.1 CN1.1 LED1.1 R5.2 R6.1 U1.4 U2.1
VCC: CN1.4 D1.2
AS5600_SCL: CN1.3 R1.1 U1.7
AS5600_SDA: CN1.2 R2.1 U1.6
DIR: R4.2 R5.1 U1.8
OUT: H1.1 U1.3
PHU: CN2.3 NOREF#3.
PHV: CN2.2 NOREF#6.
PHW: CN2.1 NOREF#8.
$1N429: LED1.2 R3.2
$1N686: R6.2 U1.5
$1N2645: C4.2 C5.2 D1.1 U2.3

Pads without a net: CN1 5 6; CN2 4 5; NOREF 9; NOREF#2 9; NOREF#4 9; NOREF#5 9; NOREF#7 9; NOREF#9 9; NOREF#10 9; NOREF#11 9

## Via types
v1: diameter 0.508, hole 0.3, Top Layer to Bottom Layer, 22 vias

## Routing (per net, layer and track width the routed paths; a pad name or vN(x,y) marks a point on that pad's centre or on a via; arc(x,y) is an arc through that point)
3V3: length 23.3
  Top Layer w0.203: R3.1 19.31,34.67 U2.4 ; U2.2 25.75,26.41 27.15,25.01 27.15,23.36 28.92,21.58 28.92,18.37 R4.1 R1.2 R2.2
GND:
  vias: v1(1.62,18.66) v1(1.62,18.03) v1(1.62,17.39) v1(1.62,8) v1(1.62,7.36) v1(1.62,6.73) v1(2.25,18.66) v1(2.25,18.03) v1(2.25,17.39) v1(2.25,8) v1(2.25,7.36) v1(2.25,6.73) v1(2.89,18.66) v1(2.89,18.03) v1(2.89,17.39) v1(2.89,8) v1(2.89,7.36) v1(2.89,6.73)
AS5600_SCL: length 25.5
  Top Layer w0.254: R1.1 26.64,17.5 U1.7 v1(23.61,17.5) ; CN1.3 v1(28.94,34.62)
  Bottom Layer w0.254: v1(23.61,17.5) 23.61,29.28 v1(28.94,34.62)
AS5600_SDA: length 27.3
  Top Layer w0.254: R2.1 26.24,16.23 U1.6 v1(23.61,16.23) ; CN1.2 v1(29.94,34.62)
  Bottom Layer w0.254: v1(29.94,34.62) 29.94,34.54 24.35,28.95 24.35,16.98 v1(23.61,16.23)
DIR: length 5.2
  Top Layer w0.203: U1.8 27.02,18.77 R4.2 R5.1
OUT: length 2.9
  Top Layer w0.254: H1.1 16.6,16.23 U1.3
$1N429: length 1.8
  Top Layer w0.203: R3.2 21.49,35.35 LED1.2
$1N686: length 2.3
  Top Layer w0.203: U1.5 25.05,13.1 R6.2

## Copper pours and planes (outline as drawn; the poured copper is in the pictures)
3V3 on Top Layer: 26.47,25.52 26.77,25.81 26.77,27.05 26.48,27.33 21.75,27.33 20.51,28.57 18.3,28.57 17.83,28.1 17.83,24.79 18.89,23.72 18.89,19.39 18.38,18.88 18.38,17.39 18.64,17.14 20.35,17.14 20.62,17.41 20.62,18.89 20.06,19.45 20.06,24.03 20.54,24.51 20.54,24.52 21.55,25.52
GND on Top Layer: -7.65,43.05 41.37,43.05 41.37,-2.29 -7.65,-2.29
GND on Bottom Layer: -3.21,47.24 43.28,47.24 43.28,-4.2 -3.21,-4.2
VCC on Top Layer: 27.52,34.28 27.65,34.41 28.23,34.41 28.36,34.28 28.36,32.86 29.57,31.65 30.93,31.65 31.85,30.73 31.85,29.74 31.41,29.31 29.99,29.31 28.83,30.46 28.83,30.72 27.52,32.04
PHU on Top Layer: 0.35,31.74 0.87,32.27 0.89,32.27 6.71,32.27 6.73,32.28 8.85,34.4 8.87,34.41 13.46,34.39 14.15,34.39 14.15,34.4 14.15,32.78 14.14,32.76 14.13,32.75 14.12,32.74 10.18,32.74 6.19,28.75 6.17,28.74 0.94,28.74 0.35,29.33
PHU on Bottom Layer: 0.35,31.75 0.87,32.27 0.89,32.28 6.71,32.28 6.73,32.29 8.85,34.41 8.88,34.42 13.47,34.4 14.15,34.4 14.16,34.4 14.16,32.78 14.15,32.76 14.14,32.75 14.12,32.75 10.31,32.75 6.41,28.84 6.17,28.74 0.95,28.74 0.35,29.34
PHV on Top Layer: 14.46,34.4 15.16,34.4 15.16,34.4 15.16,32.65 7.03,24.52 1.04,24.52 0.32,25.24 0.32,27.45 1.04,28.17 6.22,28.17 10.5,32.45 14.1,32.45 14.46,32.81
PHV on Bottom Layer: 14.46,34.4 15.16,34.4 15.16,34.41 15.16,32.27 7.41,24.52 1.04,24.52 0.32,25.24 0.32,27.45 1.04,28.17 6.22,28.17 10.5,32.45 14.23,32.45 14.46,32.68
PHW on Top Layer: 15.46,34.39 16.16,34.39 16.16,32.73 16.16,30.43 11.27,25.54 11.27,23.81 8.03,20.57 0.75,20.57 0.31,21.01 0.31,23.22 0.9,23.81 6.83,23.81 15.46,32.44
PHW on Bottom Layer: 15.46,34.4 16.17,34.4 16.17,32.73 16.16,30.44 11.27,25.55 11.27,23.81 8.04,20.58 0.75,20.58 0.31,21.02 0.31,23.23 0.9,23.81 7.21,23.81 15.46,32.06
$1N2645 on Top Layer: 23.87,30.45 24.27,30.85 28.22,30.85 28.42,30.66 28.42,29.76 28.2,29.55 27,29.54 26.68,29.12 26.68,28.15 26.47,27.93 24.1,27.93 23.87,28.17

Small or netless copper shapes (teardrops, artwork), in the pictures only: 30 on Top Layer, 4 on Bottom Layer

## Text on the board
Top Silkscreen Layer: Ver1.2@kkl | U  V  W | U V W | V CL DA G | DIR_UP | DIR_DOWN | M2.5x4 | OUTPUT | MOTOR0 | I2C_IN | AS5600
